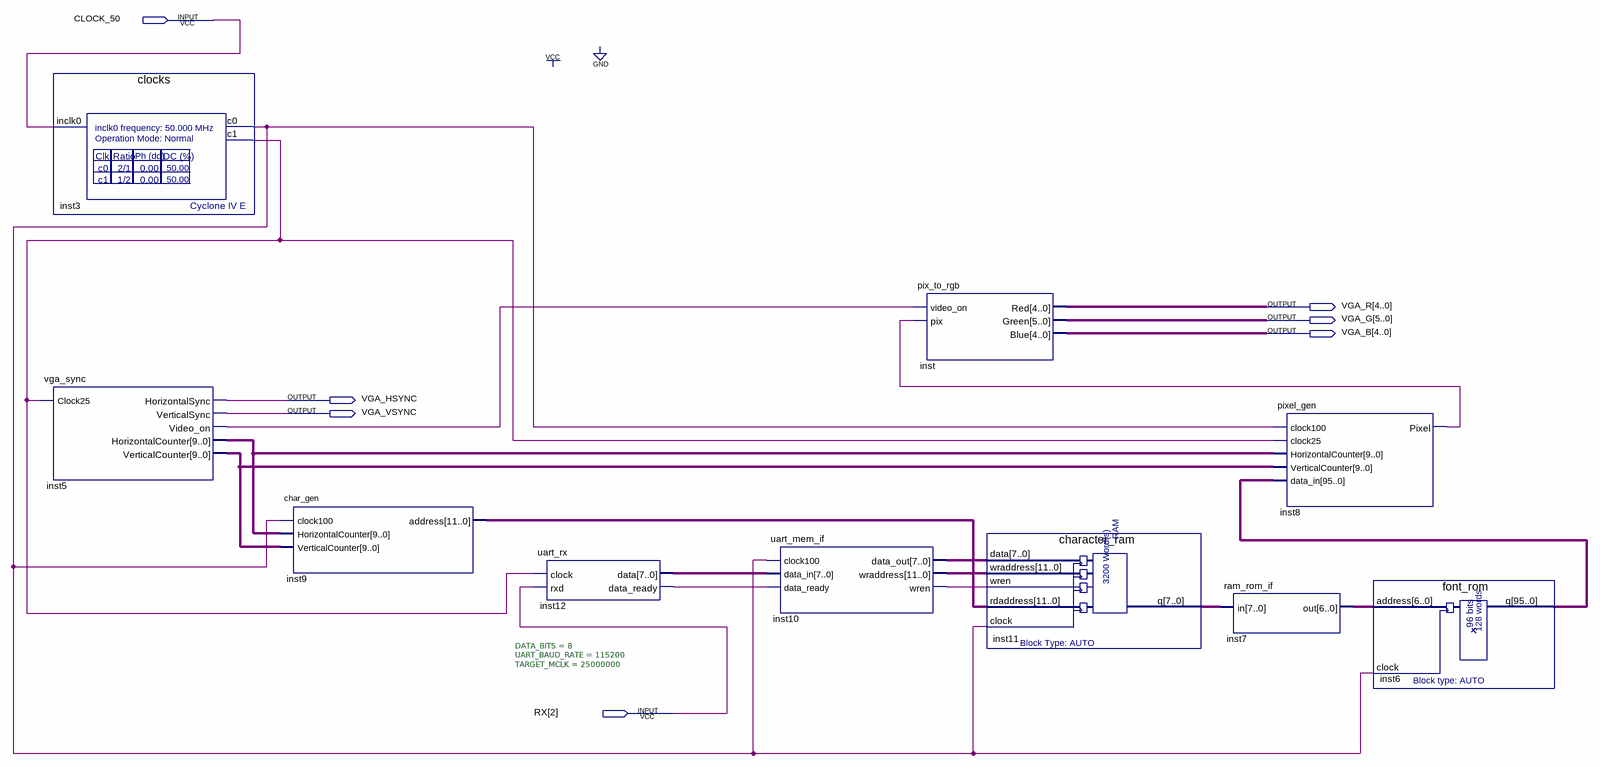
[diagram p0: schematic sheet]
// Quartus schematic vga_controller.bdf as structural Verilog: 10 symbols, 7 pins
module vga_controller (
  input  CLOCK_50,
  input  [2:2] RX,
  output [4:0] VGA_R,
  output [5:0] VGA_G,
  output [4:0] VGA_B,
  output VGA_HSYNC,
  output VGA_VSYNC
);

  wire inst3_c0, inst3_c1, inst5_video_on, inst8_pixel, inst10_wren, inst12_data_ready;
  wire [6:0] inst7_out;
  wire [7:0] inst10_data_out, inst11_q, inst12_data;
  wire [9:0] inst5_horizontalcounter, inst5_verticalcounter;
  wire [11:0] inst9_address, inst10_wraddress;
  wire [95:0] inst6_q;

  clocks inst3 (.inclk0(CLOCK_50), .c0(inst3_c0), .c1(inst3_c1));
  vga_sync inst5 (
    .Clock25(inst3_c1), .HorizontalSync(VGA_HSYNC), .VerticalSync(VGA_VSYNC), .Video_on(inst5_video_on),
    .HorizontalCounter(inst5_horizontalcounter), .VerticalCounter(inst5_verticalcounter));
  char_gen inst9 (
    .clock100(inst3_c0), .HorizontalCounter(inst5_horizontalcounter),
    .VerticalCounter(inst5_verticalcounter), .address(inst9_address));
  uart_rx #(.DATA_BITS(8), .UART_BAUD_RATE(115200), .TARGET_MCLK(25000000)) inst12 (
    .clock(inst3_c1), .rxd(RX[2]), .data(inst12_data), .data_ready(inst12_data_ready));
  uart_mem_if inst10 (
    .clock100(inst3_c0), .data_in(inst12_data), .data_ready(inst12_data_ready), .data_out(inst10_data_out),
    .wraddress(inst10_wraddress), .wren(inst10_wren));
  pix_to_rgb inst (.video_on(inst5_video_on), .pix(inst8_pixel), .Red(VGA_R), .Green(VGA_G), .Blue(VGA_B));
  character_ram inst11 (
    .data(inst10_data_out), .wraddress(inst10_wraddress), .wren(inst10_wren), .rdaddress(inst9_address),
    .clock(inst3_c0), .q(inst11_q));
  ram_rom_if inst7 (.in(inst11_q), .out(inst7_out));
  pixel_gen inst8 (
    .clock100(inst3_c0), .clock25(inst3_c1), .HorizontalCounter(inst5_horizontalcounter),
    .VerticalCounter(inst5_verticalcounter), .data_in(inst6_q), .Pixel(inst8_pixel));
  font_rom inst6 (.address(inst7_out), .clock(inst3_c0), .q(inst6_q));
endmodule
